# Altium schematic sheet Sheet.SchDoc
size A4
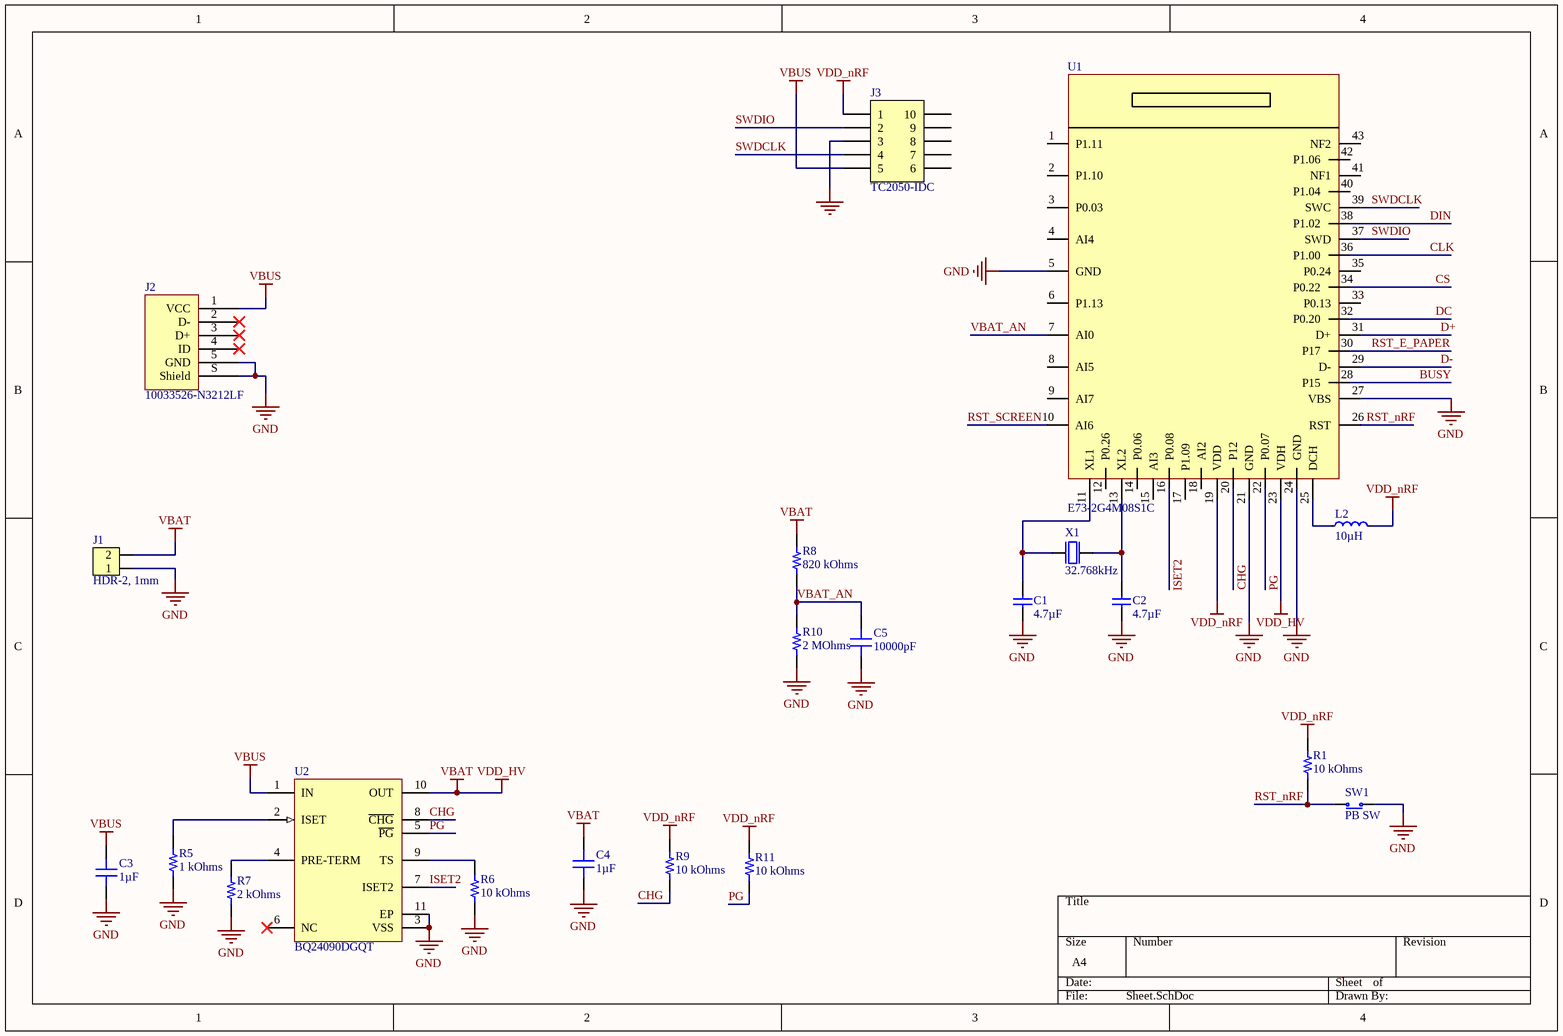
[diagram p0: Sheet.SchDoc]

## Parts
C1  4.7µF  [CAPC1608X06L]
C2  4.7µF  [CAPC1608X06L]
C3  1µF  [CAP 0603_1608]
C4  1µF  [CAP 0603_1608]
C5  10000pF  [CAP 0603_1608]
J1  HDR-2, 1mm  [SM02B-SRSS-TB]
J2  10033526-N3212LF  [FCI USB 10033526-N3212LF]
J3  TC2050-IDC  [TC2050-IDC-NLFP]  (no BOM)
L2  10µH  [INDC1608X06L]
R1  10 kOhms  [RES 0603_1608]
R5  1 kOhms  [RES 0603_1608]
R6  10 kOhms  [RES 0603_1608]
R7  2 kOhms  [RES 0603_1608]
R8  820 kOhms  [RES 0603_1608]
R9  10 kOhms  [RES 0603_1608]
R10  2 MOhms  [RES 0603_1608]
R11  10 kOhms  [RES 0603_1608]
SW1  PB SW  [Switch-PB-6.2x6.3mm-SMD]
U1  E73-2G4M08S1C  [E73-2G4M08S1C]
U2  BQ24090DGQT  [DGQ0010D_M]
X1  32.768kHz  [XTAL_3215]

## Nets
GND: C1.1 C2.1 C3.1 C4.1 C5.1 J1.1 J2.5(GND) J2.S(Shield) J3.3 R5.1 R6.1 R7.1 R10.1 SW1.2(COM) U1.5(GND) U1.21(GND) U1.24(GND) U1.27(VBS) U2.3(VSS) U2.11(EP)
VBAT: C4.2 J1.2 R8.2 U1.23(VDH) U2.10(OUT)  [also labelled VDD_HV]
VBUS: C3.2 J2.1(VCC) J3.5 U2.1(IN)
VDD_nRF: J3.1 L2.2 R1.1 R9.1 R11.1 U1.19(VDD)
BUSY: U1.28(P15)
CHG: R9.2 U1.20(P12) U2.8(~{CHG})
CLK: U1.36(P1.00)
CS: U1.34(P0.22)
D+: U1.31(D+)
D-: U1.29(D-)
DC: U1.32(P0.20)
DIN: U1.38(P1.02)
ISET2: U1.16(P0.08) U2.7(ISET2)
PG: R11.2 U1.22(P0.07) U2.5(~{PG})
RST_E_PAPER: U1.30(P17)
RST_nRF: R1.2 SW1.1(N.O) U1.26(RST)
RST_SCREEN: U1.10(AI6)
SWDCLK: J3.4 U1.39(SWC)
SWDIO: J3.2 U1.37(SWD)
VBAT_AN: C5.2 R8.1 R10.2 U1.7(AI0)
NetC1_2: C1.2 U1.11(XL1) X1.1(inp)
NetC2_2: C2.2 U1.13(XL2) X1.2(out)
NetL2_1: L2.1 U1.25(DCH)
NetR5_2: R5.2 U2.2(ISET)
NetR6_2: R6.2 U2.9(TS)
NetR7_2: R7.2 U2.4(PRE-TERM)

Not connected (* = marked no-connect by the designer): J2 2(D-)* 3(D+)* 4(ID)*; J3 6 7 8 9 10; U1 1(P1.11) 2(P1.10) 3(P0.03) 4(AI4) 6(P1.13) 8(AI5) 9(AI7) 12(P0.26) 14(P0.06) 15(AI3) 17(P1.09) 18(AI2) 33(P0.13) 35(P0.24) 40(P1.04) 41(NF1) 42(P1.06) 43(NF2); U2 6(NC)*

## Library data of the parts
C1 C2 = CAP_0603: Capacitor, X7R, ±10%; Part Number: C0603-4µ7-6.3V-X7R; Manufacturer: Samsung; Manufacturer Part Number: CL10B475KQ8NQNC; Note: 6.3V; Artikkelnr Noca: 20039473; Artikkelnr Simpro: N.A.; LatestRevisionDate: 2015-06-10; Pin Count: 2; Publisher: Nordic Semiconductor; Published: 2015-06-10; Value: 4.7µF; Footprint Doc: 0603; Datasheet: http://media.digikey.com/pdf/Data%20Sheets/Samsung%20PDFs/CL10B475KQ8NQNC_Spec.pdf; Supplier: Digi-Key; Supplier part number: 1276-2087-1-ND; 2nd source Supplier: *; 2nd source part number: *
C3 C4 = JMK107BJ105KK-T: CAP CER 1UF 6.3V X5R 0603; Manufacturer: Taiyo Yuden; Tolerance: ±10%; Part Number: JMK107BJ105KK-T; Value: 1µF; Applications: General Purpose; Capacitance: 1µF; ComponentLink1Description: Datasheet; ComponentLink1URL: https://www.yuden.co.jp/productdata/catalog/mlcc01_e.pdf; ComponentLink2Description: DigiKey Link; ComponentLink2URL: http://digikey.com/product-detail/en/taiyo-yuden/JMK107BJ105KK-T/587-1993-1-ND/1646655; Device Package: 0603 (1608 Metric); LastUpdated: 21/01/2020 00:02:08; Lifecycle Status: Active; Minimum Order: 1; Mounting Type: Surface Mount, MLCC; Operating Temperature: -55°C ~ 85°C; Package / Case: 0603 (1608 Metric); Packaging: TapeAndReel; PartId: 2858; Part Status: Active; Price: 0.02; Series: M; Size / Dimension: 0.063" L x 0.031" W (1.60mm x 0.80mm); Supplier 1: DigiKey; Supplier Part Number 1: 587-1993-1-ND; Temperature Coefficient: X5R; Thickness (Max): 0.020" (0.50mm); Voltage - Rated: 6.3V
C5 = C0603C103K4RECAUTO: CAP CER 0603 10NF 16V X7R 10%; Manufacturer: KEMET; Part Number: C0603C103K4RECAUTO; Value: 10000pF; Applications: Automotive, ESD Protection; Capacitance: 10000pF; ComponentLink1Description: Datasheet; ComponentLink1URL: https://api.kemet.com/component-edge/download/datasheet/C0603C103K4RECAUTO.pdf; ComponentLink2Description: DigiKey Link; ComponentLink2URL: http://digikey.com/product-detail/en/kemet/C0603C103K4RECAUTO/399-17880-1-ND/8640547; Device Package: 0603 (1608 Metric); LastUpdated: 21/01/2020 00:02:00; Lifecycle Status: Active; Minimum Order: 1; Mounting Type: Surface Mount, MLCC; Operating Temperature: -55°C ~ 125°C; Package / Case: 0603 (1608 Metric); Packaging: TapeAndReel; PartId: 8251; Part Status: Active; Price: 0.02; Ratings: AEC-Q200; Series: ESD SMD Auto X7R; Size / Dimension: 0.063" L x 0.031" W (1.60mm x 0.80mm); Supplier 1: DigiKey; Supplier Part Number 1: 399-17880-1-ND; Temperature Coefficient: X7R; Thickness (Max): 0.034" (0.87mm); Tolerance: ±10%; Voltage - Rated: 16V
J1 = SM02B-SRSS-TB: 1.0mm pitch connector side entry SMD; Manufacturer: JST; Manufacturer Part Number: SM02B-SRSS-TB(LF)(SN); Part number IPS: 00000007791; Note: JST, Header; Artikkelnr Noca: 55010030; Artikkelnr Simpro: N.A.; Part Number: SM02B-SRSS-TB; Datasheet: http://www.jst-mfg.com/product/pdf/eng/eSH.pdf; Footprint Doc: SM02B-SRSS-TB; LatestRevisionDate: 2016-06-20; Pin Count: 2; Publisher: Nordic Semiconductor; Published: 2016-06-20; Value: HDR-2, 1mm; Supplier: Digi-Key; Supplier part number: 455-1802-1-ND; 2nd source Supplier: *; 2nd source part number: *
J2 = 10033526-N3212LF: CONN RCPT MINI USB B 5POS SMD RA; Manufacturer: Amphenol ICC (FCI); Connector Type: USB - mini B; Current Rating (Amps): 1A per Contact; Gender: Receptacle; Mating Cycles: 5000; Number of Contacts: 5; Number of Ports: 1; Shielding: Shielded; Voltage - Rated: 30V; Part Number: 10033526-N3212LF; ComponentLink1Description: Datasheet; ComponentLink1URL: http://www.amphenol-icc.com/media/wysiwyg/files/drawing/10033526.pdf; ComponentLink2Description: DigiKey Link; ComponentLink2URL: //digikey.com/product-detail/en/amphenol-icc-fci/10033526-N3212LF/609-4700-2-ND/4292074; Features: Board Guide, Solder Retention; LastUpdated: 09/12/2019 20:52:14; Lifecycle Status: 0; Minimum Order: 1; Mounting Feature: Horizontal; Mounting Type: Surface Mount, Right Angle; Operating Temperature: -25°C ~ 85°C; Packaging: TapeAndReel; Part Status: Active; Price: 0.39; Series: -; Supplier 1: DigiKey; Supplier Part Number 1: 609-4700-2-ND; Termination: Solder
J3 = TC2050-IDC: CBL PLUG-OF-NAILS 10-PIN; Manufacturer: Tag-Connect LLC; Artikkelnr Noca: N.A.; Part Number: TC2050-IDC-NLFP; Manufacturer Part Number: TC2050-IDC-NLFP; LatestRevisionDate: 2012-11-21; Publisher: Nordic Semiconductor; Published: 2012-11-21; Value: TC2050-IDC; Supplier: Digi-Key; Supplier part number: TC2050-IDC-NL-ND; 2nd source Supplier: *; 2nd source part number: *; Pin Count: 10; Footprint Doc: TC2050-IDC-NLFP; Artikkelnr Simpro: N.A.; ComponentLink1Description: Datasheet; ComponentLink1URL: *; ComponentLink2Description: Supplier link; ComponentLink2URL: *; HelpURL: http://www.tag-connect.com/Materials/TC2050-IDC%20Datasheet.pdf
L2 = IND_0603: Inductor, 80mA, ±10%; Part Number: L0603-10µ; Manufacturer: Taiyo Yuden; Manufacturer Part Number: LBMF1608T100K; 2nd source part number: 178-6105; Part number IPS: 00000007794; Note: LBMF1608T100K 10µH 80mA 0603; Artikkelnr Noca: 33029314; Artikkelnr Simpro: N.A.; LatestRevisionDate: 2012-09-19; Pin Count: 2; Publisher: Nordic Semiconductor; Published: 2010-02-24; Value: 10µH; Supplier: Digi-Key; Supplier part number: 587-1714-1-ND; 2nd source Supplier: Farnell; Footprint Doc: 0603; ComponentLink1Description: Datasheet; ComponentLink1URL: *; ComponentLink2Description: Supplier link; HelpURL: http://www.yuden.co.jp/ut/product/pdf/elb2_e.pdf
R1 R6 R9 R11 = RNCS0603BKE10K0: RES 10K OHM 0.1% 1/16W 0603; Manufacturer: Stackpole Electronics Inc; Power (Watts): 0.063W, 1/16W; Temperature Coefficient: ±25ppm/°C; Part Number: RNCS0603BKE10K0; Value: 10 kOhms; ComponentLink1Description: Datasheet; ComponentLink1URL: https://www.seielect.com/catalog/sei-rncs_rnch.pdf; ComponentLink2Description: DigiKey Link; ComponentLink2URL: http://digikey.com/product-detail/en/stackpole-electronics-inc/RNCS0603BKE10K0/RNCS0603BKE10K0CT-ND/1800113; Composition: Thin Film; Device Package: 0603 (1608 Metric); Features: Anti-Corrosive, Automotive AEC-Q200, Moisture Resistant; Height - Seated (Max): 0.022" (0.55mm); LastUpdated: 21/01/2020 00:25:01; Lifecycle Status: Active; Minimum Order: 1; Number of Terminations: 2; Operating Temperature: -55°C ~ 155°C; Package / Case: 0603 (1608 Metric); Packaging: TapeAndReel; PartId: 4838; Part Status: Active; Price: 0.08; Ratings: AEC-Q200; Resistance: 10 kOhms; Series: RNCS; Size / Dimension: 0.061" L x 0.031" W (1.55mm x 0.80mm); Supplier 1: DigiKey; Supplier Part Number 1: RNCS0603BKE10K0CT-ND; Supplier Device Package: 0603; Tolerance: ±0.1%
R5 = CPF0603B1K0E: RES SMD 1K OHM 0.1% 1/16W 0603; Manufacturer: TE Connectivity Passive Product; Power (Watts): 0.063W, 1/16W; Temperature Coefficient: ±25ppm/°C; Part Number: CPF0603B1K0E; Value: 1 kOhms; ComponentLink1Description: Datasheet; ComponentLink1URL: https://www.te.com/commerce/DocumentDelivery/DDEController?Action=srchrtrv&DocNm=1773200&DocType=DS&DocLang=English; ComponentLink2Description: DigiKey Link; ComponentLink2URL: http://digikey.com/product-detail/en/te-connectivity-passive-product/CPF0603B1K0E/A119887CT-ND/4966485; Composition: Thin Film; Device Package: 0603 (1608 Metric); Height - Seated (Max): 0.022" (0.55mm); LastUpdated: 21/01/2020 00:24:55; Lifecycle Status: Active; Minimum Order: 1; Number of Terminations: 2; Operating Temperature: -55°C ~ 155°C; Package / Case: 0603 (1608 Metric); Packaging: TapeAndReel; PartId: 4877; Part Status: Active; Price: 0.09; Resistance: 1 kOhms; Series: CPF, Neohm; Size / Dimension: 0.061" L x 0.031" W (1.55mm x 0.80mm); Supplier 1: DigiKey; Supplier Part Number 1: A119887CT-ND; Supplier Device Package: 0603; Tolerance: ±0.1%
R7 = RT0603BRD072KL: RES SMD 2K OHM 0.1% 1/10W 0603; Manufacturer: Yageo; Power (Watts): 0.1W, 1/10W; Temperature Coefficient: ±25ppm/°C; Part Number: RT0603BRD072KL; Value: 2 kOhms; ComponentLink1Description: Datasheet; ComponentLink1URL: https://www.yageo.com/upload/media/product/productsearch/datasheet/rchip/PYu-RT_1-to-0.01_RoHS_L_11.pdf; ComponentLink2Description: DigiKey Link; ComponentLink2URL: http://digikey.com/product-detail/en/yageo/RT0603BRD072KL/YAG1626CT-ND/5139074; Composition: Thin Film; Device Package: 0603 (1608 Metric); Height - Seated (Max): 0.022" (0.55mm); LastUpdated: 21/01/2020 00:24:44; Lifecycle Status: Active; Minimum Order: 1; Number of Terminations: 2; Operating Temperature: -55°C ~ 155°C; Package / Case: 0603 (1608 Metric); Packaging: TapeAndReel; PartId: 5635; Part Status: Active; Price: 0.04; Resistance: 2 kOhms; Series: RT; Size / Dimension: 0.063" L x 0.031" W (1.60mm x 0.80mm); Supplier 1: DigiKey; Supplier Part Number 1: YAG1626CT-ND; Supplier Device Package: 0603; Tolerance: ±0.1%
R8 = CRGP0603F820K: CRGP 0603 820K 1%; Manufacturer: TE Connectivity Passive Product; Power (Watts): 0.25W, 1/4W; Temperature Coefficient: ±100ppm/°C; Part Number: CRGP0603F820K; Value: 820 kOhms; ComponentLink1Description: Datasheet; ComponentLink1URL: https://www.te.com/commerce/DocumentDelivery/DDEController?Action=srchrtrv&DocNm=9-1773463-9&DocType=DS&DocLang=English; ComponentLink2Description: DigiKey Link; ComponentLink2URL: http://digikey.com/product-detail/en/te-connectivity-passive-product/CRGP0603F820K/A130451CT-ND/8578283; Composition: Thick Film; Device Package: 0603 (1608 Metric); Features: Pulse Withstanding; Height - Seated (Max): 0.022" (0.55mm); LastUpdated: 21/01/2020 00:24:55; Lifecycle Status: Active; Minimum Order: 1; Number of Terminations: 2; Operating Temperature: -55°C ~ 155°C; Package / Case: 0603 (1608 Metric); Packaging: TapeAndReel; PartId: 5029; Part Status: Active; Price: 0.02; Resistance: 820 kOhms; Series: CRGP; Size / Dimension: 0.063" L x 0.031" W (1.60mm x 0.80mm); Supplier 1: DigiKey; Supplier Part Number 1: A130451CT-ND; Supplier Device Package: 0603; Tolerance: ±1%
R10 = RMCF0603FT2M00: RES 2M OHM 1% 1/10W 0603; Manufacturer: Stackpole Electronics Inc; Power (Watts): 0.1W, 1/10W; Temperature Coefficient: ±200ppm/°C; Part Number: RMCF0603FT2M00; Value: 2 MOhms; ComponentLink1Description: Datasheet; ComponentLink1URL: https://www.seielect.com/catalog/sei-rmcf_rmcp.pdf; ComponentLink2Description: DigiKey Link; ComponentLink2URL: http://digikey.com/product-detail/en/stackpole-electronics-inc/RMCF0603FT2M00/RMCF0603FT2M00CT-ND/1943145; Composition: Thick Film; Device Package: 0603 (1608 Metric); Features: Automotive AEC-Q200; Height - Seated (Max): 0.022" (0.55mm); LastUpdated: 21/01/2020 00:24:27; Lifecycle Status: Active; Minimum Order: 1; Number of Terminations: 2; Operating Temperature: -55°C ~ 155°C; Package / Case: 0603 (1608 Metric); Packaging: CutTape; PartId: 6213; Part Status: Active; Price: 0.10; Ratings: AEC-Q200; Resistance: 2 MOhms; Series: RMCF; Size / Dimension: 0.061" L x 0.031" W (1.55mm x 0.80mm); Supplier 1: DigiKey; Supplier Part Number 1: RMCF0603FT2M00CT-ND; Supplier Device Package: 0603; Tolerance: ±1%
SW1 = Switch-PB-6.2x6.3mm-SMD: Tactile Switch, SPNO, SMD, 160gf, 6.2x6.3x2.5mm; Manufacturer: Dailywell; Manufacturer Part Number: TS604VM1-025BR-R; 2nd source part number: 688-SKHUALE010; Part number IPS: 00000007812; Artikkelnr Noca: 50019106; Artikkelnr Simpro: N.A.; Part Number: Switch-PB-6.2x6.3mm-SMD; Datasheet: \\hizz\pro\app9717\Datasheet\switches\Dailywell\TS604VM1-025BR-R.pdf; Footprint Doc: Switch-PB-6.2x6.3mm-SMD; LatestRevisionDate: 2016-04-21; Pin Count: 4; Publisher: Nordic Semiconductor; Published: 2010-02-01; Value: PB SW; Note: *; Supplier: Cabcon; Supplier part number: TS604VM1-025BR-R; 2nd source Supplier: Mouser
U2 = CMP-0321-00918-2: 1 A, Single Input, Single Cell Li-Ion Battery Charger with 10 K ohm NTC, 4.5 V, -40 to 150 degC, 10-pin MSOP-PowerPAD (DGQ), Green (RoHS & no Sb/Br); Manufacturer: Texas Instruments; NiCd: N; SubFamily: Battery Charge Management; Vin(Min)(V): 4.5; ComponentLink1URL: http://www.ti.com/general/docs/lit/getliterature.tsp?genericPartNumber=BQ24090&fileType=pdf; PackageDescription: 10-Pin PowerPAD Plastic Small Outline 0.5 mm Pitch, Exposed Pad; Lead Acid: N; Mounting Technology: Surface Mount; Over Voltage Protection: N; ComponentLink1Description: Datasheet; Li-Polymer: N; Li-Ion: N; Eco-Plan: Green (RoHS & no Sb/Br); DatasheetVersion: SLUS968C; PartNumber: BQ24090DGQT; PackageReference: DGQ0010D; PackageVersion: revF, Nov-2011; NiMH: N; Code_JEDEC: MO-187-BA-T
X1 = XTAL_SMD3215: XTAL SMD 2012, 32.768kHz, 9pF, ±20ppm; Part Number: XTAL_SMD3215_32.768kHz_9pF_NDK; Manufacturer: NDK; Manufacturer Part Number: NX3215SA-32.768K-STD-MUA-9; Note: XTAL SMD 32.768kHz; Artikkelnr Noca: N.A.; Datasheet: *; LatestRevisionDate: 2017-10-23; Pin Count: 2; Publisher: Nordic Semiconductor; Published: 2017-10-23; Value: 32.768kHz; Supplier: *; Supplier part number: *; 2nd source Supplier: *; 2nd source part number: *; Footprint Doc: XTAL_3215; Artikkelnr Simpro: N.A.